# EAGLE design schematic_r3 (EAGLE 7.4.0)
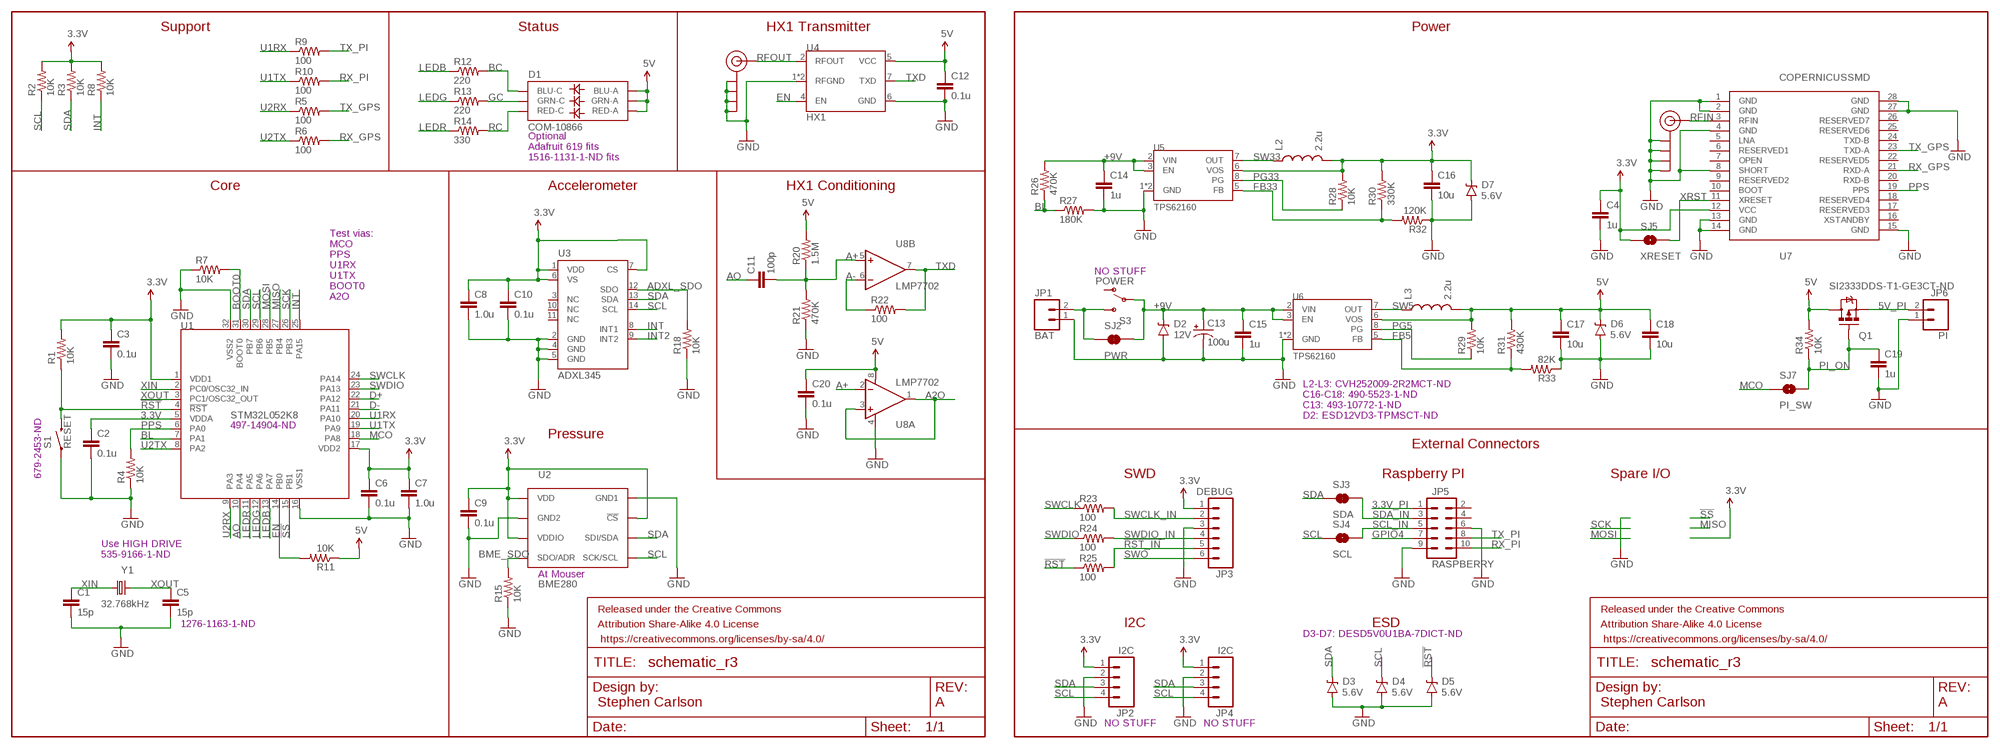
[diagram p0: schematic, sheet 1]

## Parts
C1  15p  CAP0805  [0805]
C2  0.1u  CAP0805  [0805]
C3  0.1u  CAP0805  [0805]
C4  1u  CAP0805  [0805]
C5  15p  CAP0805  [0805]
C6  0.1u  CAP0805  [0805]
C7  1.0u  CAP0805  [0805]
C8  1.0u  CAP0805  [0805]
C9  0.1u  CAP0805  [0805]
C10  0.1u  CAP0805  [0805]
C11  100p  CAP0805  [0805]
C12  0.1u  CAP0805  [0805]
C13  100u  CAP_POLPTH2  [CPOL-RADIAL-10UF-25V]
C14  1u  CAP0805  [0805]
C15  1u  CAP0805  [0805]
C16  10u  CAP0805  [0805]
C17  10u  CAP0805  [0805]
C18  10u  CAP0805  [0805]
C19  1u  CAP0805  [0805]
C20  0.1u  CAP0805  [0805]
D1  COM-10866  LED-TRICOLOR-5050NO_IC  [LED-TRICOLOR-5050]
D2  12V  DIODE-ZENER5.6V  [SOD-323]
D3  5.6V  DIODE-ZENER5.6V  [SOD-323]
D4  5.6V  DIODE-ZENER5.6V  [SOD-323]
D5  5.6V  DIODE-ZENER5.6V  [SOD-323]
D6  5.6V  DIODE-ZENER5.6V  [SOD-323]
D7  5.6V  DIODE-ZENER5.6V  [SOD-323]
FRAME1  FRAME-LETTERNO_PACKAGE  [DUMMY]
FRAME2  FRAME-LETTERNO_PACKAGE  [DUMMY]
J$1  SMA_EDGE  [SMA-EDGE]
J$2  SMA_EDGE  [SMA-EDGE]
JP1  BAT  M02PTH  [1X02]
JP2  I2C  M04LOCK  [1X04_LOCK]
JP3  DEBUG  M06LOCK  [1X06_LOCK]
JP4  I2C  M04LOCK  [1X04_LOCK]
JP5  RASPBERRY  M05X2PTH  [AVR_ICSP]
JP6  PI  M02PTH  [1X02]
L2  2.2u  INDUCTOR1008  [1008]
L3  2.2u  INDUCTOR1008  [1008]
Q1  SI2333DDS-T1-GE3CT-ND  MOSFET-PCHANNELSMD  [SOT23-3]
R1  10K  RESISTOR0805-RES  [0805]
R2  10K  RESISTOR0805-RES  [0805]
R3  10K  RESISTOR0805-RES  [0805]
R4  10K  RESISTOR0805-RES  [0805]
R5  100  RESISTOR0805-RES  [0805]
R6  100  RESISTOR0805-RES  [0805]
R7  10K  RESISTOR0805-RES  [0805]
R8  10K  RESISTOR0805-RES  [0805]
R9  100  RESISTOR0805-RES  [0805]
R10  100  RESISTOR0805-RES  [0805]
R11  10K  RESISTOR0805-RES  [0805]
R12  220  RESISTOR0805-RES  [0805]
R13  220  RESISTOR0805-RES  [0805]
R14  330  RESISTOR0805-RES  [0805]
R15  10K  RESISTOR0805-RES  [0805]
R18  10K  RESISTOR0805-RES  [0805]
R20  1.5M  RESISTOR0805-RES  [0805]
R21  470K  RESISTOR0805-RES  [0805]
R22  100  RESISTOR0805-RES  [0805]
R23  100  RESISTOR0805-RES  [0805]
R24  100  RESISTOR0805-RES  [0805]
R25  100  RESISTOR0805-RES  [0805]
R26  470K  RESISTOR0805-RES  [0805]
R27  180K  RESISTOR0805-RES  [0805]
R28  10K  RESISTOR0805-RES  [0805]
R29  10K  RESISTOR0805-RES  [0805]
R30  330K  RESISTOR0805-RES  [0805]
R31  430K  RESISTOR0805-RES  [0805]
R32  120K  RESISTOR0805-RES  [0805]
R33  82K  RESISTOR0805-RES  [0805]
R34  10K  RESISTOR0805-RES  [0805]
S1  RESET  SWITCH  [TACTILE-PTH-THIN]
S3  POWER  SWITCH-SPDTPTH  [SWITCH-SPDT]
SJ2  PWR  JUMPER-PAD-2-NC_BY_TRACE  [PAD-JUMPER-2-NC_BY_TRACE_YES_SILK]
SJ3  SDA  JUMPER-PAD-2-NC_BY_TRACE  [PAD-JUMPER-2-NC_BY_TRACE_YES_SILK]
SJ4  SCL  JUMPER-PAD-2-NC_BY_TRACE  [PAD-JUMPER-2-NC_BY_TRACE_YES_SILK]
SJ5  XRESET  JUMPER-PAD-2-NOYES_SILK  [PAD-JUMPER-2-NO_YES_SILK]
SJ7  PI_SW  JUMPER-PAD-2-NOYES_SILK  [PAD-JUMPER-2-NO_YES_SILK]
U1  STM32L052K8  STM32L05K  [TQFP32-08]
U2  BME280  [BME280_LGA]
U3  ADXL345  [LGA14]
U4  HX1  [1X12]
U5  TPS62160  [MSOP8]
U6  TPS62160  [MSOP8]
U7  COPERNICUSSMD  [COPERNICUS]
U8  LMP7702  OPAMP-DUALU  [SO08]
Y1  32.768kHz  CRYSTAL  [ABS25]

## Nets
3.3V: C2.1 C3.1 C4.1 C6.1 C7.1 C8.1 C9.1 C10.1 C16.1 D7.C JP2.1 JP3.1 JP4.1 L2.2 R1.2 R2.2 R3.2 R8.2 R28.2 R30.2 SJ5.1 U1.1(VDD1) U1.5(VDDA) U1.17(VDD2) U2.P$2(!CS) U2.P$6(VDDIO) U2.P$8(VDD) U3.1(VDD) U3.6(VS) U3.7(CS) U5.6(VOS) U7.12(VCC)
3.3V_PI: JP5.1
5V: C12.1 C17.1 C18.1 C20.1 D1.1(GRN-A) D1.2(RED-A) D1.3(BLU-A) D6.C L3.2 Q1.3(D) R11.1 R20.2 R29.2 R31.2 R34.2 U4.5(VCC) U6.6(VOS) U8.8(A:V+)
5V_PI: JP6.2 Q1.2(S)
!RST!: D5.C R1.1 R25.1 S1.2 U1.4(!RST!)
!RST_IN!: JP3.5 R25.2
!SS!: U1.15(PB1)
+9V: C13.1(+) C14.1 C15.1 D2.C R26.2 S3.2(P) SJ2.2 U5.2(VIN) U5.3(EN) U6.2(VIN) U6.3(EN)
A2O: U8.1(A:OUT) U8.3(A:+IN)
A+: C11.2 R20.1 R21.2 U8.2(A:-IN) U8.5(B:+IN)
A-: R22.1 U8.6(B:-IN)
ADXL_SDO: R18.2 U3.12(SDO)
AO: C11.1 U1.10(PA4)
BC: D1.4(BLU-C) R12.2
BL: R26.1 R27.1 U1.7(PA1)
BME_SDO: R15.2 U2.P$5(SDO/ADR)
BOOT0: R7.2 U1.31(BOOT0)
D+: U1.22(PA12)
D-: U1.21(PA11)
EN: R11.2 U1.14(PB0) U4.4(EN)
FB5: R31.1 R33.2 U6.5(FB)
FB33: R30.1 R32.2 U5.5(FB)
GC: D1.6(GRN-C) R13.2
GND: C1.2 C2.2 C3.2 C4.2 C5.2 C6.2 C7.2 C8.2 C9.2 C10.2 C12.2 C13.2(-) C14.2 C15.2 C16.2 C17.2 C18.2 C19.2 C20.2 D2.A D3.A D4.A D5.A D6.A D7.A J$1.GND@0(GND) J$1.GND@1(GND) J$1.GND@2(GND) J$1.GND@3(GND) J$2.GND@0(GND) J$2.GND@1(GND) J$2.GND@2(GND) J$2.GND@3(GND) JP1.1 JP2.2 JP3.3 JP4.2 JP5.6 JP5.9 JP6.1 R4.1 R7.1 R15.1 R18.1 R21.1 R27.2 R32.1 R33.1 S1.1 U1.16(VSS1) U1.32(VSS2) U2.P$1(GND1) U2.P$7(GND2) U3.2(GND) U3.4(GND) U3.5(GND) U4.1(RFGND) U4.3(RFGND) U4.6(GND) U5.1(GND) U5.4(GND) U6.1(GND) U6.4(GND) U7.1(GND) U7.2(GND) U7.4(GND) U7.8(SHORT) U7.13(GND) U7.14(GND) U7.15(GND) U7.27(GND) U7.28(GND) U8.4(A:V-)
GPIO4: JP5.7
INT: R8.1 U1.25(PA15) U3.8(INT1)
INT2: U3.9(INT2)
LEDB: R12.1 U1.13(PA7)
LEDG: R13.1 U1.12(PA6)
LEDR: R14.1 U1.11(PA5)
MCO: SJ7.1 U1.18(PA8)
MISO: U1.27(PB4)
MOSI: U1.28(PB5)
PG5: R29.1 U6.8(PG)
PG33: R28.1 U5.8(PG)
PI_ON: C19.1 Q1.1(G) R34.1 SJ7.2
PPS: R4.2 U1.6(PA0) U7.19(PPS)
RC: D1.5(RED-C) R14.2
RFIN: J$2.SIG(SIGNAL) U7.3(RFIN)
RFOUT: J$1.SIG(SIGNAL) U4.2(RFOUT)
RX_GPS: R6.2 U7.21(RXD-A)
RX_PI: JP5.10 R10.2
SCK: U1.26(PB3)
SCL: D4.C JP2.4 JP4.4 R2.1 SJ4.1 U1.29(PB6) U2.P$4(SCK/SCL) U3.14(SCL)
SCL_IN: JP5.5 SJ4.2
SDA: D3.C JP2.3 JP4.3 R3.1 SJ3.1 U1.30(PB7) U2.P$3(SDI/SDA) U3.13(SDA)
SDA_IN: JP5.3 SJ3.2
SW5: L3.1 U6.7(OUT)
SW33: L2.1 U5.7(OUT)
SWCLK: R23.1 U1.24(PA14)
SWCLK_IN: JP3.2 R23.2
SWDIO: R24.1 U1.23(PA13)
SWDIO_IN: JP3.4 R24.2
SWO: JP3.6
TX_GPS: R5.2 U7.23(TXD-A)
TX_PI: JP5.8 R9.2
TXD: R22.2 U4.7(TXD) U8.7(B:OUT)
U1RX: R9.1 U1.20(PA10)
U1TX: R10.1 U1.19(PA9)
U2RX: R5.1 U1.9(PA3)
U2TX: R6.1 U1.8(PA2)
VIN: JP1.2 S3.3(S) SJ2.1
XIN: C1.1 U1.2(PC0/OSC32_IN) Y1.1
XOUT: C5.1 U1.3(PC1/OSC32_OUT) Y1.4
XRST: SJ5.2 U7.11(XRESET)
Unconnected: JP5.2 JP5.4 S3.1(O) U3.3(NC) U3.10(NC) U3.11(NC) U7.5(LNA) U7.6(RESERVED1) U7.7(OPEN) U7.9(RESERVED2) U7.10(BOOT) U7.16(XSTANDBY) U7.17(RESERVED3) U7.18(RESERVED4) U7.20(RXD-B) U7.22(RESERVED5) U7.24(TXD-B) U7.25(RESERVED6) U7.26(RESERVED7)

## Notes on the sheet
- Support | Status | HX1 Transmitter | Power
- Optional
  Adafruit 619 fits
  1516-1131-1-ND fits
- Core | Accelerometer | HX1 Conditioning
- NO STUFF
- Test vias:
  MCO
  PPS
  U1RX
  U1TX
  BOOT0
  A2O
- L2-L3: CVH252009-2R2MCT-ND
  C16-C18: 490-5523-1-ND
  C13: 493-10772-1-ND
  D2: ESD12VD3-TPMSCT-ND
- 497-14904-ND
- Pressure
- External Connectors
- 679-2453-ND | SWD | Raspberry PI | Spare I/O
- Use HIGH DRIVE
  535-9166-1-ND
- At Mouser
- 1276-1163-1-ND | I2C | ESD
- D3-D7: DESD5V0U1BA-7DICT-ND
- Stephen Carlson | A | Stephen Carlson | A
- NO STUFF | NO STUFF

## Library data of the parts
C1-C12 C14-C20 = SparkFun-Passives:CAP: Capacitor Standard 0603 ceramic capacitor, and 0.1" leaded capacitor.
C13 = SparkFun-Passives:CAP_POL: Capacitor Polarized These are standard SMD and PTH capacitors. Normally 10uF, 47uF, and 100uF in electrolytic and tantalum varieties. Always verify the external diameter of the through hole cap, it varies with capacity, voltage, and manufacturer. The EIA devices should be standard.
D1 = SparkFun-LED:LED-TRICOLOR-5050
D2 = SparkFun-DiscreteSemi:DIODE-ZENER: Zener Diode Production Part - 8199 3.4V Zener Voltage; PROD_ID: DIO-12442; VALUE: 5.6V
D3-D7 = SparkFun-DiscreteSemi:DIODE-ZENER: Zener Diode Production Part - 8199 3.4V Zener Voltage; PROD_ID: DIO-12442
FRAME1 FRAME2 = SparkFun-Aesthetics:FRAME-LETTER: Schematic Frame Standard 8.5x11 US Letter frame; DESIGNER: Nobody; VERSION: v01
J$1 J$2 = SparkFun-Connectors:SMA_EDGE: SMA Antenna Connector End launch SMA connector. The paste layer has been removed so that the connector can be hand soldered onto the board after reflow.
JP1 JP6 = SparkFun-Connectors:M02: Standard 2-pin 0.1" header. Use with - straight break away headers ( PRT-00116) - right angle break away headers (PRT-00553) - swiss pins (PRT-00743) - machine pins (PRT-00117) - female headers (PRT-00115) Molex polarized connector foot print use with: PRT-08233 with associated crimp pins and housings. 2.54_SCREWTERM for use with PRT-10571. 3.5mm Screw Terminal footprints for PRT-08084 5mm Screw Terminal footprints for use with PRT-08432
JP2 JP4 = SparkFun-Connectors:M04: Header 4 Standard 4-pin 0.1" header. Use with straight break away headers (SKU : PRT-00116), right angle break away headers (PRT-00553), swiss pins (PRT-00743), machine pins (PRT-00117), and female headers (PRT-00115). Molex polarized connector foot print use with SKU : PRT-08231 with associated crimp pins and housings. 1MM SMD Version SKU: PRT-10208
JP3 = SparkFun-Connectors:M06: Header 6 Standard 6-pin 0.1" header. Use with straight break away headers (SKU : PRT-00116), right angle break away headers (PRT-00553), swiss pins (PRT-00743), machine pins (PRT-00117), and female headers (PRT-00115). Molex polarized connector foot print use with SKU : PRT-08094 with associated crimp pins and housings. NOTES ON THE VARIANTS LOCK and LOCK_LONGPADS... This footprint was designed to help hold the alignment of a through-hole component (i.e. 6-pin header) while soldering it into place. You may notice that each hole has been shifted either up or down by 0.005 of an inch from it's more standard position (which is a perfectly straight line). This slight alteration caused the pins (the squares in the middle) to touch the edges of the holes. Because they are alternating, it causes a "brace" to hold the component in place. 0.005 has proven to be the perfect amount of "off-center" position when using our standard breakaway headers. Although looks a little odd when you look at the bare footprint, once you have a header in there, the alteration is very hard to notice. Also,if you push a header all the way into place, it is covered up entirely on the bottom side. This idea of altering the position of holes to aid alignment will be further integrated into the Sparkfun Library for other footprints. It can help hold any component with 3 or more connection pins.
JP5 = SparkFun-Connectors:M05X2: Header 5x2 Standard 10-pin dual row 0.1" header. Commonly used with AVR-ISP. Use with Spark Fun Electronics SKU: PRT-00778
L2 L3 = HAB:INDUCTOR: INDUCTOR Standard inductor, with some new packages Why do inductors never come in standard packages!?
Q1 = SparkFun-DiscreteSemi:MOSFET-PCHANNEL: Generic PMOSFET IRLML2244 - TRANS-11153 (SOT-23 -20V -4.3A) (1.Gate 2.Source 3.Drain) FQP27P06 - COM-10349 <http://www.sparkfun.com/products/10349> (TO-220 -60V -27A) (1.Gate 2.Source 3.Drain)
R1-R15 R18 R20-R34 = SparkFun-Passives:RESISTOR: Resistor Basic schematic elements and footprints for 0603, 1206, and PTH resistors.
S1 = HAB:SWITCH: SWITCH Package for the MJTP1250, a thinner and lighter PTH push button switch.
S3 = SparkFun-Electromechanical:SWITCH-SPDT: SPDT Switch Simple slide switch, Spark Fun Electronics SKU : COM-00102 DPDT SMT slide switch, AYZ0202, SWCH-08179; PROD_ID: SWCH-08261
SJ2-SJ4 = SparkFun-Passives:JUMPER-PAD-2-NC_BY_TRACE
SJ5 SJ7 = SparkFun-Passives:JUMPER-PAD-2-NO
U1 = stm32xx:STM32L05*K: STM32L052K STM32 low-power L0 series microcontroller, 64 KBytes FLASH, 8 KB RAM, 32-LQFP package
U2 = BME280ComponentLibrary:BME280; PROD_ID: IC-13090
U3 = SparkFun-Sensors:ADXL345: 3-axis SPI/I2C 2/4/8/16g accelerometer
U4 = HAB:HX1: Radiometrix HX1 High-power VHF Narrow Band 300 mW Transmitter
U5 U6 = HAB:TPS62160: TPS62160 Adjustable switch-mode D-CAP2 regulator
U7 = SparkFun-RF:COPERNICUS: Copernicus II GPS- Trimble recommended layout and paste layer. Footprint production proven. Spark Fun Electronics SKU : GPS-07951
U8 = SparkFun-AnalogIC:OPAMP-DUAL: Generic op-amp footprint
Y1 = HAB:CRYSTAL: CRYSTAL Crystal oscillators in packages not in SparkFun-FreqCtl

## Board
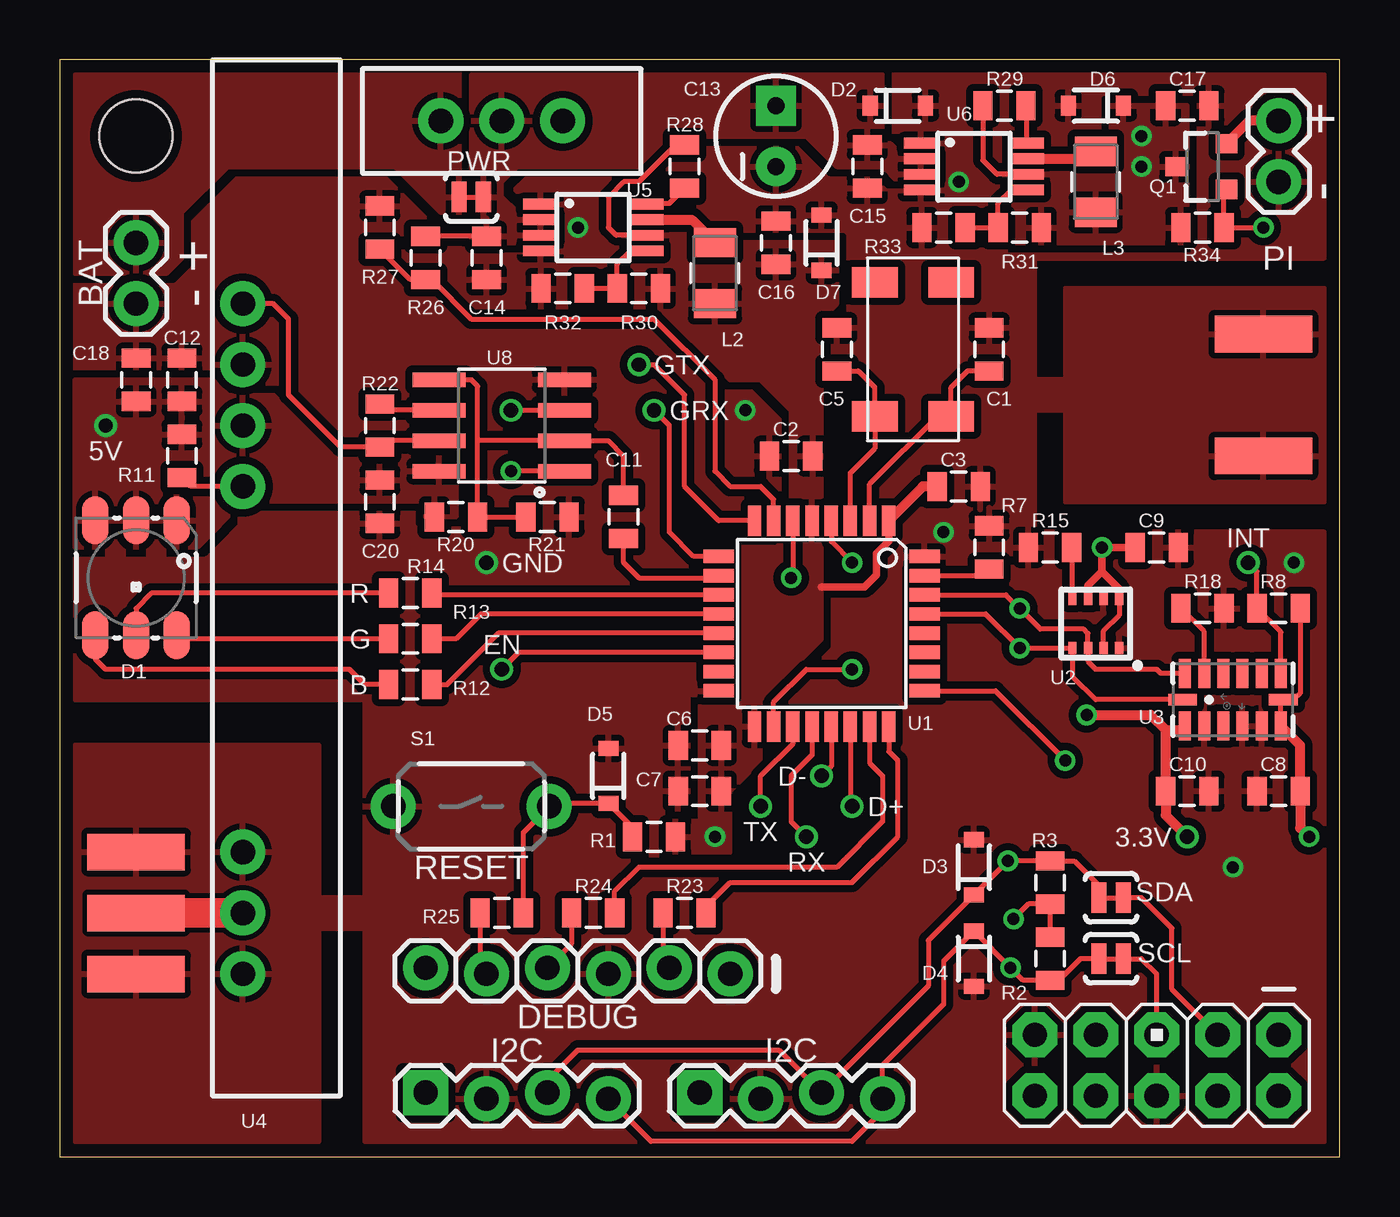
[diagram p1: board, top side]
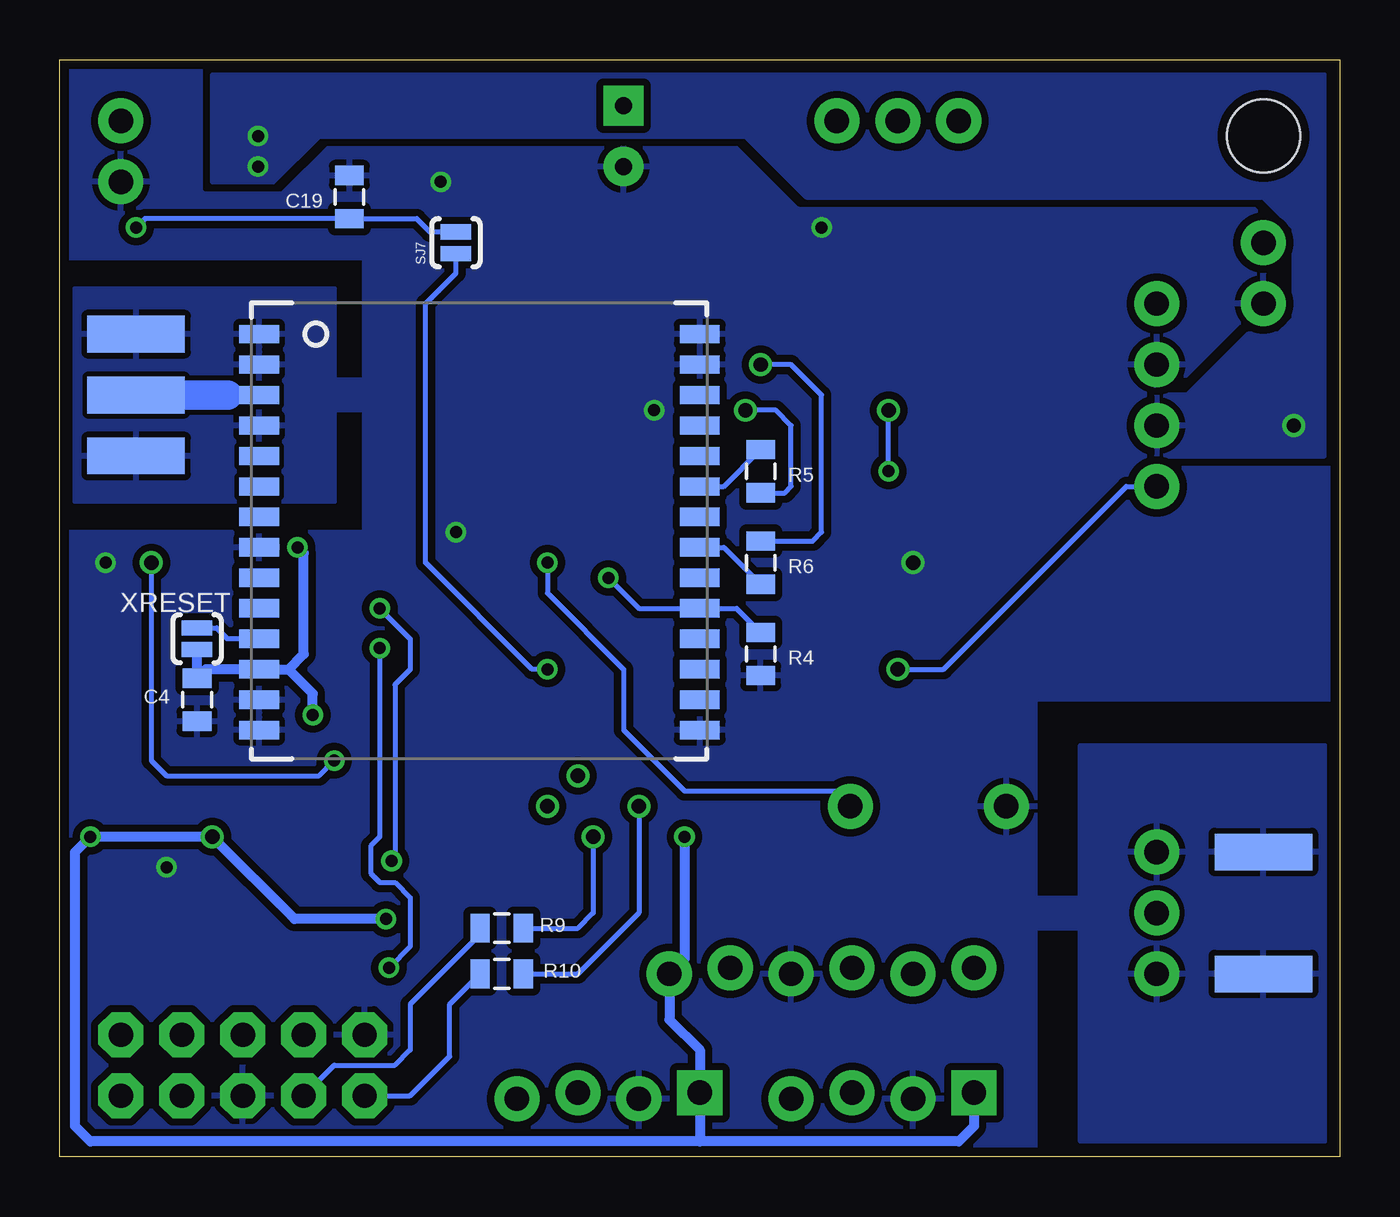
[diagram p2: board, bottom side, seen from below]

Size 53.34 x 45.72 mm. Coordinates in mm from the lower left corner, seen from the top.
Outline: 0,0 53.34,0 53.34,45.72 0,45.72 0,0
Copper layers (1*16): Top 0.0356mm / dielectric 1.5011mm / Bottom 0.0356mm
Design rules "LaenPCBOrder *": minimum track width 6mil, minimum drill 13mil, track to track 6mil, track to pad 6mil, pad to pad 6mil, via to via 6mil, smd to smd 6mil, copper to edge 15mil, drill to drill 6mil, minimum pad ring 7mil, minimum via ring 7mil, stop-mask expansion 3mil, vias tented up to drill 20mil, thermal gap 10mil
Holes 3.05 mm at 3.17,42.55

### Footprints (pad centres in the part's own frame; a part is rotated, then mirrored left to right if it is on the bottom)
0805 = smd 0.8 x 1.2: 1 -0.9,0; 2 0.9,0
CPOL-RADIAL-10UF-25V = drill 0.7 pad 1.651 square: 1 1.27,0 | drill 0.7 pad 1.651: 2 -1.27,0
LED-TRICOLOR-5050 = smd 2 x 1.1: 1 -2.4,1.7; 2 -2.4,0; 3 -2.4,-1.7; 4 2.4,-1.7; 5 2.4,0; 6 2.4,1.7
SOD-323 = smd 0.63 x 0.83: A 1.15,0; C -1.15,0
SMA-EDGE = smd 1.524 x 4.064: GND@0 0,0; GND@1 5.08,0; SIG 2.54,0 | smd 1.524 x 4.064 bottom: GND@2 0,0; GND@3 5.08,0
1X02 = drill 1.016 pad 1.88: 1 0,0; 2 2.54,0
1X04_LOCK = drill 1.016 pad 1.88 square: 1 0,0.127 | drill 1.016 pad 1.88: 2 2.54,-0.127; 3 5.08,0.127; 4 7.62,-0.127
1X06_LOCK = drill 1.016 pad 1.88: 1 0,0; 2 2.54,-0.254; 3 5.08,0; 4 7.62,-0.254; 5 10.16,0; 6 12.7,-0.254
AVR_ICSP = drill 1.016 pad 1.88 octagon: 1 -1.27,5.08; 2 1.27,5.08; 3 -1.27,2.54; 4 1.27,2.54; 5 -1.27,0; 6 1.27,0; 7 -1.27,-2.54; 8 1.27,-2.54; 9 -1.27,-5.08; 10 1.27,-5.08
1008 = smd 1.753 x 1.219: 1 0,1.27; 2 0,-1.27
SOT23-3 = smd 0.8 x 0.9: 1 -0.95,-1; 2 0.95,-1; 3 0,1.1
TACTILE-PTH-THIN = drill 1.016 pad 1.88: 1 -3.251,0; 2 3.251,0
SWITCH-SPDT = drill 1.016 pad 1.88: 1 0,2.54; 2 0,0; 3 0,-2.54
PAD-JUMPER-2-NC_BY_TRACE_YES_SILK = smd 0.635 x 1.27: 1 -0.508,0; 2 0.508,0
PAD-JUMPER-2-NO_YES_SILK = smd 0.635 x 1.27: 1 -0.45,0; 2 0.45,0
TQFP32-08 = smd 1.27 x 0.559: 1 -4.293,2.8; 2 -4.293,2; 3 -4.293,1.2; 4 -4.293,0.4; 5 -4.293,-0.4; 6 -4.293,-1.2; 7 -4.293,-2; 8 -4.293,-2.8; 17 4.293,-2.8; 18 4.293,-2; 19 4.293,-1.2; 20 4.293,-0.4; 21 4.293,0.4; 22 4.293,1.2; 23 4.293,2; 24 4.293,2.8 | smd 0.559 x 1.27: 9 -2.8,-4.293; 10 -2,-4.293; 11 -1.2,-4.293; 12 -0.4,-4.293; 13 0.4,-4.293; 14 1.2,-4.293; 15 2,-4.293; 16 2.8,-4.293; 25 2.8,4.293; 26 2,4.293; 27 1.2,4.293; 28 0.4,4.293; 29 -0.4,4.293; 30 -1.2,4.293; 31 -2,4.293; 32 -2.8,4.293
BME280_LGA = smd 0.5 x 0.35: P$1 1.025,0.975; P$2 1.025,0.325; P$3 1.025,-0.325; P$4 1.025,-0.975; P$5 -1.025,-0.975; P$6 -1.025,-0.325; P$7 -1.025,0.325; P$8 -1.025,0.975
LGA14 = smd 0.5 x 1.2: 1 2,1.1; 2 1.2,1.1; 3 0.4,1.1; 4 -0.4,1.1; 5 -1.2,1.1; 6 -2,1.1; 8 -2,-1.1; 9 -1.2,-1.1; 10 -0.4,-1.1; 11 0.4,-1.1; 12 1.2,-1.1; 13 2,-1.1 | smd 1.2 x 0.5: 7 -2.1,0; 14 2.1,0
1X12 = drill 1.016 pad 1.88: 1 0,0; 2 2.54,0; 3 5.08,0; 4 20.32,0; 5 22.86,0; 6 25.4,0; 7 27.94,0
MSOP8 = smd 0.45 x 1.45: 1 -0.975,-2.2; 2 -0.325,-2.2; 3 0.325,-2.2; 4 0.975,-2.2; 5 0.975,2.2; 6 0.325,2.2; 7 -0.325,2.2; 8 -0.975,2.2
COPERNICUS = smd 0.762 x 1.651: 1 0,-18.364; 2 1.27,-18.364; 3 2.54,-18.364; 4 3.81,-18.364; 5 5.08,-18.364; 6 6.35,-18.364; 7 7.62,-18.364; 8 8.89,-18.364; 9 10.16,-18.364; 10 11.43,-18.364; 11 12.7,-18.364; 12 13.97,-18.364; 13 15.24,-18.364; 14 16.51,-18.364; 15 16.51,0; 16 15.24,0; 17 13.97,0; 18 12.7,0; 19 11.43,0; 20 10.16,0; 21 8.89,0; 22 7.62,0; 23 6.35,0; 24 5.08,0; 25 3.81,0; 26 2.54,0; 27 1.27,0; 28 0,0
SO08 = smd 0.61 x 2.21: 1 -1.905,-2.616; 2 -0.635,-2.616; 3 0.635,-2.616; 4 1.905,-2.616; 5 1.905,2.616; 6 0.635,2.616; 7 -0.635,2.616; 8 -1.905,2.616
ABS25 = smd 1.27 x 1.905: 1 -2.794,-1.587; 2 2.794,-1.587; 3 2.794,1.587; 4 -2.794,1.587

### Placement (x,y rotation side)
C1  38.73,33.66 90 top
C2  30.48,29.21 180 top
C3  37.47,27.94 0 top
C4  47.62,19.05 270 bottom
C5  32.38,33.66 90 top
C6  26.67,17.14 180 top
C7  26.67,15.24 180 top
C8  50.8,15.24 180 top
C9  45.72,25.4 0 top
C10  46.99,15.24 0 top
C11  23.5,26.67 90 top
C12  5.08,32.38 90 top
C13  29.84,42.55 90 top
C14  17.78,37.47 270 top
C15  33.66,41.27 270 top
C16  29.84,38.1 90 top
C17  46.99,43.81 0 top
C18  3.17,32.38 90 top
C19  41.27,40.01 90 bottom
C20  13.34,27.3 270 top
D1  3.17,24.13 270 top
D2  34.92,43.81 0 top
D3  38.1,12.06 90 top
D4  38.1,8.26 270 top
D5  22.86,15.88 90 top
D6  43.18,43.81 180 top
D7  31.75,38.1 90 top
FRAME1  0,53.34 0 top  (outside the outline)
FRAME2  0,52.07 0 top  (outside the outline)
J$1  3.17,7.62 90 top
J$2  50.16,29.21 90 bottom
JP1  3.17,35.56 90 top
JP2  26.67,2.54 0 top
JP3  27.94,7.62 180 top
JP4  15.24,2.54 0 top
JP5  45.72,3.81 270 top
JP6  50.8,40.64 90 top
L2  27.3,36.83 0 top
L3  43.18,40.64 0 top
Q1  47.62,41.27 90 top
R1  24.77,13.34 0 top
R2  41.27,8.26 90 top
R3  41.27,11.43 270 top
R4  24.13,20.95 90 bottom
R5  24.13,28.57 90 bottom
R6  24.13,24.77 270 bottom
R7  38.73,25.4 270 top
R8  50.8,22.86 0 top
R9  34.92,9.53 180 bottom
R10  34.92,7.62 180 bottom
R11  5.08,29.21 270 top
R12  14.61,19.68 180 top
R13  14.61,21.59 180 top
R14  14.61,23.5 180 top
R15  41.27,25.4 0 top
R18  47.62,22.86 180 top
R20  16.51,26.67 180 top
R21  20.32,26.67 180 top
R22  13.34,30.48 270 top
R23  26.04,10.16 180 top
R24  22.23,10.16 180 top
R25  18.41,10.16 180 top
R26  15.24,37.47 90 top
R27  13.34,38.73 90 top
R28  26.04,41.27 90 top
R29  39.37,43.81 180 top
R30  24.13,36.2 0 top
R31  40.01,38.73 0 top
R32  20.95,36.2 0 top
R33  36.83,38.73 0 top
R34  47.62,38.73 180 top
S1  17.14,14.61 0 top
S3  18.41,43.18 270 top
SJ2  17.14,40.01 0 top
SJ3  43.81,10.79 0 top
SJ4  43.81,8.26 0 top
SJ5  47.62,21.59 90 bottom
SJ7  36.83,38.1 90 bottom
U1  31.75,22.23 270 top
U2  43.18,22.23 270 top
U3  48.9,19.05 180 top
U4  7.62,7.62 90 top
U5  22.23,38.73 270 top
U6  38.1,41.27 270 top
U7  26.67,34.29 270 bottom
U8  18.41,30.48 90 top
Y1  35.56,33.66 90 top

### Tracks (layer width: path | path; a pad name or v marks a point on that pad's centre or on a via)
3.3V  (via drill 0.5, 0.6)
  Top 0.203: U5.6 23.18,38.41 22.86,38.73 22.86,40.01 23.5,40.64 24.13,40.64 25.66,42.17 R28.2 | R2.2 R3.2 40.38,10.53 v39.75,9.91 | U2.P$2 43.51,21.91 44.16,22.57 U2.P$8 | R8.2 51.7,19.32 51.44,19.05 U3.7 50.9,18.95 U3.6
  Top 0.305: U2.P$6 42.85,23.8 43.43,24.38 | 44.19,23.28 U2.P$8 44.16,23.66 43.43,24.38 | 31.75,23.75 33.53,23.75 34.04,24.26 34.04,25.15 34.55,25.66 U1.1 | C9.1 v43.43,25.4 43.43,24.38
  Top 0.406: 46.09,17.78 C10.1 46.09,14.23 v46.99,13.34 | U3.6 51.7,17.14 C8.1 51.7,13.71 v52.07,13.34 | C3.1 35.97,27.94 U1.1 | v42.8,18.41 45.45,18.41 46.09,17.78 | 46.09,17.78 46.73,17.78 U3.1
  Bottom 0.406: SJ5.1 C4.1 47.26,20.32 U7.12 43.81,20.32 | JP4.1 15.24,1.27 15.88,0.64 26.67,0.64 | 26.67,0.64 52.07,0.64 52.7,1.27 52.7,12.7 v52.07,13.34 v46.99,13.34 43.56,9.91 v39.75,9.91 | 26.67,0.64 JP2.1 26.67,4.45 27.94,5.71 JP3.1 27.3,8.26 v27.3,13.34 | 43.81,20.32 43.18,20.95 43.18,25.15 v43.43,25.4 | v42.8,18.41 42.8,19.3 43.81,20.32
  pour Top (isolate 0.305, rank 2): 23.5,38.73 23.5,35.56 24.13,34.92 25.4,34.92 27.94,32.38 29.21,32.38 30.48,31.11 30.48,26.04 29.84,25.4 27.94,25.4 27.94,18.8 26.67,18.8 26.67,13.97 25.4,13.97 25.4,12.7 27.94,12.7 27.94,15.24 29.21,16.51 29.21,19.05 31.75,21.59 31.75,34.92 32.38,35.56 32.38,38.1 26.67,38.1 26.04,38.73
5V  (via drill 0.5, 0.6)
  Top 0.203: R29.2 38.47,41.54 39.06,40.95 U6.6
  other vias: 45.09,41.27 1.91,30.48 45.09,42.55
  pour Top (isolate 0.305, rank 2): 16.51,29.21 16.51,26.67 15.24,26.67 15.24,27.3 7.62,27.3 5.71,25.4 0.64,25.4 0.64,32.38 6.35,32.38 6.99,31.75 8.89,31.75 11.43,29.21
  pour Top (isolate 0.305, rank 2): 39.37,41.27 39.37,38.1 46.99,38.1 46.99,43.81 43.81,43.81 43.81,41.27
  pour Bottom (isolate 0.305, rank 2): 46.99,45.09 46.99,40.64 44.45,40.64 42.55,42.55 24.77,42.55 22.23,40.01 3.17,40.01 1.91,38.73 1.91,34.92 2.54,34.29 3.81,34.29 6.35,31.75 7.62,31.75 7.62,29.21 0.64,29.21 0.64,45.09
5V_PI
  Top 0.406: JP6.2 49.58,43.18 Q1.2
!RST!  (via drill 0.5)
  Top 0.203: R25.1 19.32,13.52 S1.2 20.52,14.72 D5.C 23.86,13.72 R1.1 | U1.4 32.15,25.64 v33.02,24.77
  Bottom 0.203: v33.02,24.77 33.02,23.5 29.84,20.32 29.84,17.78 27.3,15.24 21.03,15.24 S1.2
!RST_IN!
  Top 0.203: R25.2 17.52,7.88 JP3.5
+9V
  Top 0.203: C14.1 R26.2
  pour Top (isolate 0.305): 17.14,45.09 17.14,38.1 20.32,38.1 20.32,39.37 19.05,39.37 18.41,40.01 18.41,40.64 19.05,41.27 24.13,41.27 25.4,42.55 31.11,42.55 32.38,41.27 34.29,41.27 34.92,40.64 36.2,40.64 36.2,41.91 34.92,41.91 34.29,42.55 34.29,45.09
A2O  (via drill 0.5, 0.6)
  Top 0.203: U8.1 v18.8,28.57 | v18.8,31.11 U8.3
  Bottom 0.203: v18.8,28.57 v18.8,31.11
A+
  Top 0.203: R21.2 R20.1 17.41,29.84 | C11.2 23.5,29.21 22.86,29.84 U8.2 17.41,29.84 | U8.5 17.14,32.38 17.41,32.12 17.41,29.84
A-
  Top 0.203: U8.6 13.6,31.11 R22.1
ADXL_SDO
  Top 0.203: U3.12 47.7,21.89 R18.2
AO
  Top 0.203: U1.10 27.36,24.13 24.13,24.13 23.5,24.77 C11.1
BC
  Top 0.203: R12.2 12.7,19.68 12.06,20.32 1.91,20.32 1.48,20.75 D1.4
BL
  Top 0.203: R27.1 14.61,36.56 R26.1 15.51,36.56 17.14,34.92 24.77,34.92 27.3,32.38 27.3,28.57 27.94,27.94 29.21,27.94 29.75,27.4 U1.7
BME_SDO
  Top 0.203: R15.2 42.17,23.28 U2.P$5
BOOT0
  Top 0.203: U1.31 38.46,24.23 R7.2
D+  (via drill 0.6)
  Top 0.203: U1.22 32.95,14.68 v33.02,14.61
D-  (via drill 0.6)
  Top 0.203: U1.21 32.15,16.27 v31.75,15.88
EN  (via drill 0.6)
  Top 0.203: U4.4 5.45,27.94 R11.2 | U1.14 19.12,21.02 v18.41,20.32
  Bottom 0.203: v18.41,20.32 16.51,20.32 8.89,27.94 U4.4
FB5
  Top 0.203: R33.2 R31.1 39.1,39.74 39.66,40.3 U6.5
FB33
  Top 0.203: R32.2 R30.1 23.23,37.2 23.79,37.76 U5.5
GC
  Top 0.203: R13.2 5.01,21.59 D1.6
GND  (via drill 0.5, 0.6)
  other vias: 28.57,31.11 17.78,24.77 21.59,38.73 37.47,40.64 51.44,24.77 48.9,12.06 36.83,26.04
  pour Bottom (isolate 0.305, rank 3): 53.34,45.72 0,45.72 0,19.05 12.7,19.05 12.7,0 53.34,0 53.34,26.04 40.64,26.04 40.64,37.47 53.34,37.47
  pour Top (isolate 0.305, rank 3): 52.7,45.09 0.64,45.09 0.64,19.05 12.7,19.05 12.7,0.64 52.7,0.64 52.7,26.04 40.64,26.04 40.64,37.47 52.7,37.47
  pour Bottom (isolate 0.203, rank 2): 41.91,36.2 41.91,32.38 40.64,32.38 40.64,31.11 41.91,31.11 41.91,27.3 52.7,27.3 52.7,36.2
  pour Top (isolate 0.203): 41.91,36.2 41.91,32.38 40.64,32.38 40.64,31.11 41.91,31.11 41.91,27.3 52.7,27.3 52.7,36.2
  pour Top (isolate 0.203): 0.64,17.14 0.64,0.64 10.79,0.64 10.79,9.53 12.7,9.53 12.7,10.79 10.79,10.79 10.79,17.14
  pour Bottom (isolate 0.203): 0.64,17.14 0.64,0.64 10.79,0.64 10.79,9.53 12.7,9.53 12.7,10.79 10.79,10.79 10.79,17.14
INT  (via drill 0.5, 0.6)
  Top 0.203: U3.8 50.9,21.86 R8.1 49.9,24.39 v49.53,24.77 | U1.25 38.99,19.43 v41.91,16.51
  Bottom 0.203: v49.53,24.77 49.53,16.51 48.9,15.88 42.55,15.88 v41.91,16.51
LEDB
  Top 0.203: U1.13 18.28,21.82 16.14,19.68 R12.1
LEDG
  Top 0.203: U1.12 17.55,22.62 16.51,21.59 R13.1
LEDR
  Top 0.203: U1.11 15.57,23.43 R14.1
MCO  (via drill 0.5)
  Top 0.203: U1.18 29.75,18.95 31.11,20.32 v33.02,20.32
  Bottom 0.203: SJ7.1 36.83,36.83 38.1,35.56 38.1,24.77 33.66,20.32 v33.02,20.32
PG5
  Top 0.203: U6.8 40.3,43.78 R29.1
PG33
  Top 0.203: U5.8 24.45,39.74 25.4,39.74 R28.1
PI_ON  (via drill 0.5)
  Top 0.203: Q1.1 48.52,40.23 R34.1 v50.16,38.73
  Bottom 0.203: SJ7.2 37.91,38.55 38.47,39.1 C19.1 49.8,39.1 v50.16,38.73
PPS  (via drill 0.5)
  Top 0.203: U1.6 30.55,24.2 v30.48,24.13
  Bottom 0.203: R4.2 25.14,22.86 U7.19 29.21,22.86 v30.48,24.13
RC
  Top 0.203: R14.2 3.81,23.5 3.17,22.86 D1.5
RFIN
  Bottom 0.203: 46.35,31.75 U7.3
  Bottom 1.232: J$2.SIG 46.35,31.75
RFOUT
  Top 1.232: J$1.SIG U4.2
RX_GPS
  Bottom 0.203: 24.39,24.13 R6.2 25.66,25.4 U7.21
RX_PI
  Bottom 0.203: JP5.10 38.73,2.54 37.09,4.18 37.09,6.35 R10.2
SCL  (via drill 0.5)
  Top 0.203: U3.14 43.18,19.05 42.2,20.02 U2.P$4 v40.01,21.2 38.58,22.62 U1.29 | SJ4.1 42.55,8.26 41.65,7.36 R2.1 40.15,7.36 v39.63,7.88 D4.C 36.83,8.13 36.83,6.35 34.29,3.81 JP2.4 34.29,1.91 33.02,0.64 24.64,0.64 JP4.4
  Bottom 0.203: v40.01,21.2 40.01,13.34 40.39,12.95 40.39,11.81 40.01,11.43 39.37,11.43 38.73,10.79 38.73,8.77 v39.63,7.88
SCL_IN
  Top 0.203: JP5.5 45.72,7.62 45.09,8.26 SJ4.2
SDA  (via drill 0.5)
  Top 0.203: U1.30 39.44,23.43 v40.01,22.86 40.87,22 42.67,22 42.85,21.81 U2.P$3 42.85,20.64 43.18,20.32 45.72,20.32 45.89,20.15 U3.13 | SJ3.1 43.31,11.3 42.28,12.33 R3.1 v39.52,12.33 D3.C 36.2,9.01 36.2,7.11 JP2.3 29.97,4.45 21.59,4.45 20.32,3.17 JP4.3
  Bottom 0.203: v40.01,22.86 38.73,21.59 38.73,20.32 39.37,19.68 39.37,12.47 v39.52,12.33
SDA_IN
  Top 0.203: JP5.3 46.35,6.99 46.35,9.53 45.09,10.79 SJ3.2
SW5
  Top 0.406: U6.7 42.87,41.6 L3.1
SW33
  Top 0.406: U5.7 26.34,39.06 L2.1
SWCLK
  Top 0.203: U1.24 34.55,16.89 34.92,16.51 34.92,13.34 33.02,11.43 27.94,11.43 26.93,10.43 R23.1
SWCLK_IN
  Top 0.203: R23.2 25.14,8.14 JP3.2
SWDIO
  Top 0.203: U1.23 33.75,16.41 34.29,15.88 34.29,13.97 32.38,12.06 24.13,12.06 23.12,11.06 R24.1
SWDIO_IN
  Top 0.203: R24.2 21.32,8.88 JP3.4
TX_GPS
  Bottom 0.203: 24.39,29.21 R5.2 25.66,27.94 U7.23
TX_PI
  Bottom 0.203: JP5.8 41.91,3.81 39.37,3.81 38.73,4.45 38.73,6.35 35.83,9.26 R9.2
TXD
  Top 0.203: U8.7 13.6,29.84 R22.2 11.7,29.58 9.53,31.75 9.53,34.92 8.89,35.56 U4.7
U1RX  (via drill 0.6)
  Top 0.203: U1.20 31.35,16.75 30.48,15.88 30.48,13.97 v31.11,13.34
  Bottom 0.203: v31.11,13.34 31.11,10.16 31.75,9.53 R9.1
U1TX  (via drill 0.6)
  Top 0.203: U1.19 30.55,17.21 29.21,15.88 v29.21,14.61
  Bottom 0.203: v29.21,14.61 29.21,10.16 31.75,7.62 R10.1
U2RX  (via drill 0.6)
  Top 0.203: U1.9 26.41,25.02 25.4,26.04 25.4,30.48 v24.77,31.11
  Bottom 0.203: R5.1 23.12,27.68 22.86,27.94 22.86,30.48 23.5,31.11 v24.77,31.11
U2TX  (via drill 0.6)
  Top 0.203: U1.8 27.46,26.52 26.04,27.94 26.04,31.75 24.77,33.02 v24.13,33.02
  Bottom 0.203: R6.1 21.96,25.66 21.59,26.04 21.59,31.75 22.86,33.02 v24.13,33.02
VIN
  pour Top (isolate 0.305, rank 2): 0.64,45.09 0.64,36.83 4.45,36.83 5.08,37.47 5.08,39.37 6.99,41.27 13.97,41.27 15.88,39.37 17.14,39.37 17.14,45.09
XIN
  Top 0.203: U1.2 33.75,28.04 36.58,30.86 Y1.1 37.15,32.07 37.84,32.76 C1.1
XOUT
  Top 0.203: U1.3 32.95,28.5 33.97,29.53 Y1.4 33.97,32.07 33.28,32.76 C5.1
XRST
  Bottom 0.203: SJ5.2 46.8,22.04 46.35,21.59 U7.11

### Text on the board
tPlace: - + | - + | GTX | GRX | 5V | GND | INT | R | G | EN | B | D- | D+ | TX | RX | 3.3V | RESET